# EAGLE design p32batt_B (EAGLE 6.5.0)
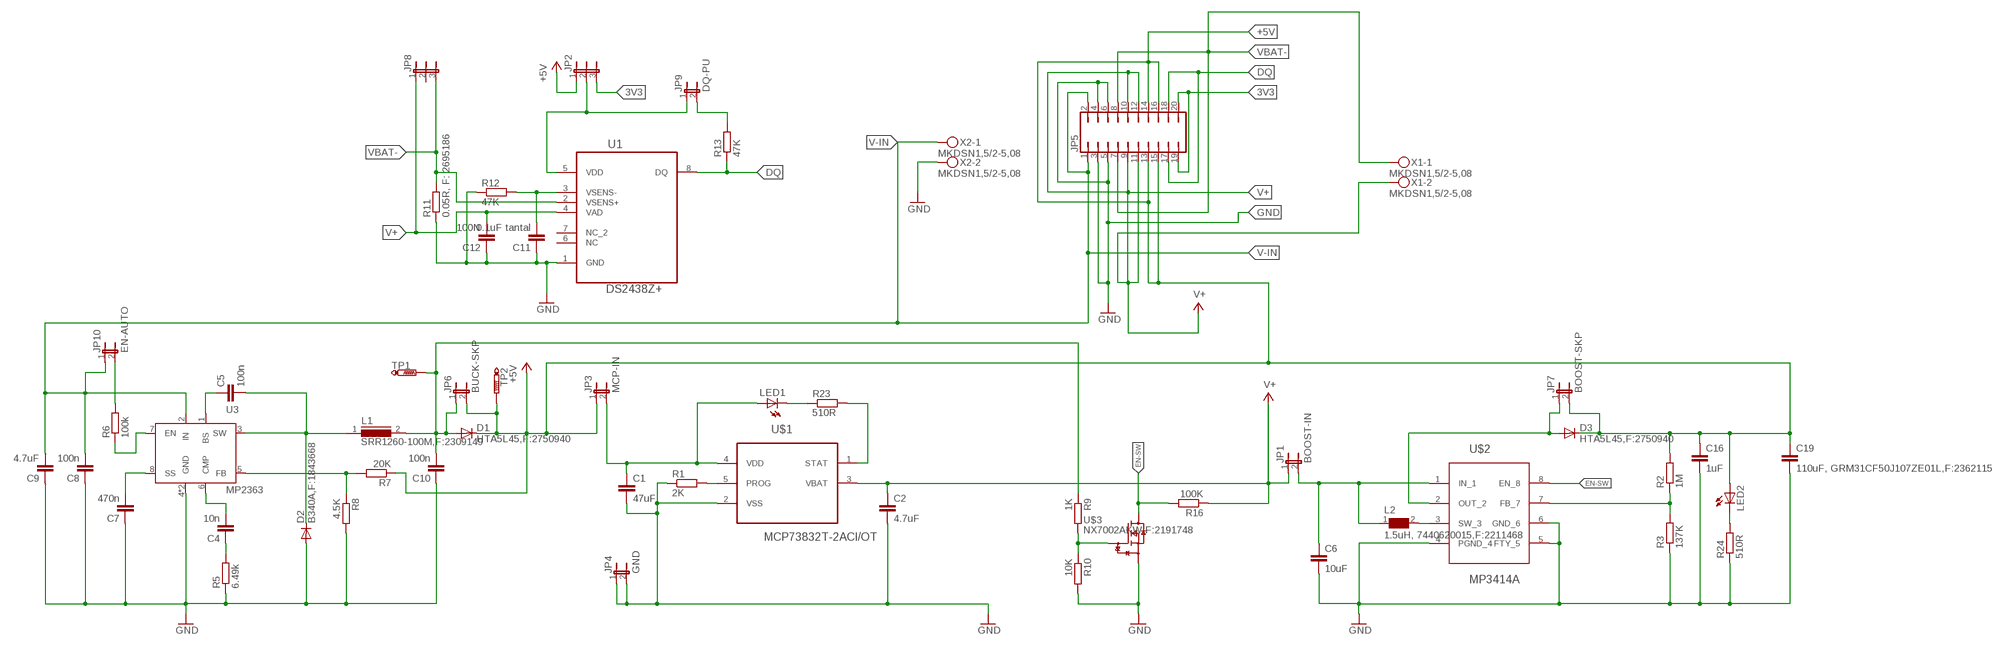
[diagram p0: schematic, sheet 1]

## Parts
C1  47uF  C-EUC1206  [C1206]
C2  4.7uF  C-EUC1206  [C1206]
C4  10n  C-EUC0805  [C0805]
C5  100n  C-EUC0805  [C0805]
C6  10uF  C-EUC1206  [C1206]
C7  470n  C-EUC0805  [C0805]
C8  100n  C-EUC0805  [C0805]
C9  4.7uF  C-EUC1206  [C1206]
C10  100n  C-EUC0805  [C0805]
C11  0.1uF tantal  C-EUC0805  [C0805]
C12  100N  C-EUC0805  [C0805]
C16  1uF  C-EUC1206  [C1206]
C19  110uF, GRM31CF50J107ZE01L,F:2362115  C-EUC1206  [C1206]
D1  HTA5L45,F:2750940  DIODE-DO214AC  [DO214AC]
D2  B340A,F:1843668  DIODE-DO214AC  [DO214AC]
D3  HTA5L45,F:2750940  DIODE-DO214AC  [DO214AC]
JP1  BOOST-IN  JP1E  [JP1]
JP2  JP2E  [JP2]
JP3  MCP-IN  JP1E  [JP1]
JP4  GND  JP1E  [JP1]
JP5  JP10Q  [JP10Q]
JP6  BUCK-SKP  JP1E  [JP1]
JP7  BOOST-SKP  JP1E  [JP1]
JP8  JP2E  [JP2]
JP9  DQ-PU  JP1E  [JP1]
JP10  EN-AUTO  JP1E  [JP1]
L1  SRR1260-100M,F:2309149  SRR1210  [SRR1210]
L2  1.5uH, 7440620015,F:2211468  WE-TPC-744062001_6823  [WE-TPC_6823]
LED1  LEDCHIPLED_0805  [CHIPLED_0805]
LED2  LEDCHIPLED_0805  [CHIPLED_0805]
R1  2K  R-EU_R0805  [R0805]
R2  1M  R-EU_R0805  [R0805]
R3  137K  R-EU_R0805  [R0805]
R5  6.49k  R-EU_R0805  [R0805]
R6  100k  R-EU_R0805  [R0805]
R7  20K  R-EU_R0805  [R0805]
R8  4.5K  R-EU_R0805  [R0805]
R9  1K  R-EU_R0805  [R0805]
R10  10K  R-EU_R0805  [R0805]
R11  0.05R, F: 2695186  R-EU_R2512  [R2512]
R12  47K  R-EU_R0805  [R0805]
R13  47K  R-EU_R0805  [R0805]
R16  100K  R-EU_R0805  [R0805]
R23  510R  R-EU_R0805  [R0805]
R24  510R  R-EU_R0805  [R0805]
TP1  PTR1PAD1-13  [P1-13]
TP2  PTR1PAD1-13  [P1-13]
U1  DS2438Z+  [SOIC127P600X175-8N]
U3  MP2363  [SOIC8E]
U$1  MCP73832T-2ACI/OT  [SOT95P280X145-5N]
U$2  MP3414A  [TSOT23-8]
U$3  NX7002AKW,F:2191748  NX7002AKW  [SOT323]
X1  MKDSN1,5/2-5,08  [MKDSN1,5/2-5,08]
X2  MKDSN1,5/2-5,08  [MKDSN1,5/2-5,08]

## Nets
3V3: JP2.3 JP5.19 JP5.20
+5V: C16.1 C19.1 D1.C D3.C JP2.1 JP3.1 JP5.13 JP5.14 JP5.15 JP5.16 JP6.2 JP7.2 LED2.A R2.2 R7.1 TP2.TP
DQ: JP5.17 JP5.18 R13.1 U1.8(DQ)
EN-SW: R16.2 U$2.8(EN_8) U$3.3(D)
GND: C1.2 C2.2 C6.2 C7.1 C8.1 C9.1 C10.1 C11.1 C12.1 C16.2 C19.2 D2.A JP4.1 JP4.2 JP5.3 JP5.4 JP5.5 JP5.6 R1.1 R3.1 R5.1 R8.2 R10.2 R11.1 R12.1 R24.1 U1.1(GND) U3.4(GND) U3.9(GND) U$1.2(VSS) U$2.4(PGND_4) U$2.5(FTY_5) U$2.6(GND_6) U$3.2(S) X2.2
N$3: R1.2 U$1.5(PROG)
N$4: R2.1 R3.2 U$2.7(FB_7)
N$5: L2.2 U$2.3(SW_3)
N$7: D3.A JP7.1 U$2.2(OUT_2)
N$8: LED2.C R24.2
N$9: R9.2 R10.1 U$3.1(G)
N$10: R23.2 U$1.1(STAT)
N$11: C1.1 JP3.2 LED1.A U$1.4(VDD)
N$12: LED1.C R23.1
N$13: JP9.2 R13.2
N$14: R6.1 U3.7(EN)
N$15: C4.2 U3.6(CMP)
N$16: C4.1 R5.2
N$17: R7.2 R8.1 U3.5(FB)
N$18: C6.1 JP1.2 L2.1 U$2.1(IN_1)
N$19: JP2.2 JP9.1 U1.5(VDD)
N$20: JP10.2 R6.2
N$21: C5.1 U3.1(BS)
N$22: C5.2 D2.C L1.1 U3.3(SW)
N$23: C7.2 U3.8(SS)
N$24: C10.2 D1.A JP6.1 L1.2 R9.1 TP1.TP
N$25: C11.2 R12.2 U1.3(VSENS-)
V+: C2.1 C12.2 JP1.1 JP5.9 JP5.10 JP5.11 JP5.12 JP8.1 R16.1 U1.4(VAD) U$1.3(VBAT) X1.2
V-IN: C8.2 C9.2 JP5.1 JP5.2 JP10.1 U3.2(IN) X2.1
VBAT-: JP5.7 JP5.8 JP8.3 R11.2 U1.2(VSENS+) X1.1
Unconnected: JP8.2 U1.6(NC) U1.7(NC_2)

## Library data of the parts
C1 C2 C4-C12 C16 C19 = rcl:C-EU: CAPACITOR, European symbol
D1-D3 = diode:DIODE-: DIODE
JP1 JP3 JP4 JP6 JP7 JP9 JP10 = jumper:JP1E: JUMPER
JP2 JP8 = jumper:JP2E: JUMPER
JP5 = jumper:JP10Q: JUMPER
L1 = inductors-2:SRR1210: SRR1210 Series - Shielded SMD Power Inductors Features : Available in E12 series Height of 4.3 mm Current rating up to 9 A RoHS compliant Applications : Input/output of DC/DC converters Power supplies
L2 = WE-TPC:WE-TPC: Shielded Tiny Power Inductor WE-TPC - Extremely flat power inductor - High current capability - High reliability and perfect soldering characteristics because of integrated soldering pad - magnetically shielded -- Portable power like PDA, digital camera, PCMICA-cards and displays -- DC/DC-converter -- Recommended for switching regulator IC's from Linear Technology, National Semiconductor, Texas Instruments and Fairchild Semiconductor; MPN: 744062001; OC_FARNELL: 1635868; OC_NEWARK: 08P2503; PACKAGE: 6823; SUPPLIER: WURTH ELEKTRONIK
LED1 LED2 = led:LED: LED OSRAM: - CHIPLED LG R971, LG N971, LY N971, LG Q971, LY Q971, LO R971, LY R971 LH N974, LH R974 LS Q976, LO Q976, LY Q976 LO Q996 - Hyper CHIPLED LW Q18S LB Q993, LB Q99A, LB R99A - SideLED LS A670, LO A670, LY A670, LG A670, LP A670 LB A673, LV A673, LT A673, LW A673 LH A674 LY A675 LS A676, LA A676, LO A676, LY A676, LW A676 LS A679, LY A679, LG A679 - Hyper Micro SIDELED® LS Y876, LA Y876, LO Y876, LY Y876 LT Y87S - SmartLED LW L88C, LW L88S LB L89C, LB L89S, LG L890 LS L89K, LO L89K, LY L89K LS L896, LA L896, LO L896, LY L896 - TOPLED LS T670, LO T670, LY T670, LG T670, LP T670 LSG T670, LSP T670, LSY T670, LOP T670, LYG T670 LG T671, LOG T671, LSG T671 LB T673, LV T673, LT T673, LW T673 LH T674 LS T676, LA T676, LO T676, LY T676, LB T676, LH T676, LSB T676, LW T676 LB T67C, LV T67C, LT T67C, LS T67K, LO T67K, LY T67K, LW E67C LS E67B, LA E67B, LO E67B, LY E67B, LB E67C, LV E67C, LT E67C LW T67C LS T679, LY T679, LG T679 LS T770, LO T770, LY T770, LG T770, LP T770 LB T773, LV T773, LT T773, LW T773 LH T774 LS E675, LA E675, LY E675, LS T675 LS T776, LA T776, LO T776, LY T776, LB T776 LHGB T686 LT T68C, LB T68C - Hyper Mini TOPLED® LB M676 - Mini TOPLED Santana® LG M470 LS M47K, LO M47K, LY M47K Source: http://www.osram.convergy.de LUXEON: - LUMILED® LXK2-PW12-R00, LXK2-PW12-S00, LXK2-PW14-U00, LXK2-PW14-V00 LXK2-PM12-R00, LXK2-PM12-S00, LXK2-PM14-U00 LXK2-PE12-Q00, LXK2-PE12-R00, LXK2-PE12-S00, LXK2-PE14-T00, LXK2-PE14-U00 LXK2-PB12-K00, LXK2-PB12-L00, LXK2-PB12-M00, LXK2-PB14-N00, LXK2-PB14-P00, LXK2-PB14-Q00 LXK2-PR12-L00, LXK2-PR12-M00, LXK2-PR14-Q00, LXK2-PR14-R00 LXK2-PD12-Q00, LXK2-PD12-R00, LXK2-PD12-S00 LXK2-PH12-R00, LXK2-PH12-S00 LXK2-PL12-P00, LXK2-PL12-Q00, LXK2-PL12-R00 Source: www.luxeon.com KINGBRIGHT: KA-3528ASYC Source: www.kingbright.com
R1-R3 R5-R13 R16 R23 R24 = rcl:R-EU_: RESISTOR, European symbol
TP1 TP2 = testpad:PTR1: TEST PIN
U1 = Maxim_By_element14_Batch_1:DS2438Z+: Smart Battery Monitor; MPN: DS2438Z+; OC_FARNELL: 1455593; OC_NEWARK: 27K7484; PACKAGE: SOIC-8; SUPPLIER: Maxim
U3 = mps:MP2363
U$1 = Microchip-MCP73832T-2ACI_OT:MCP73832T-2ACI/OT: Charge Management Controller; MPN: MCP73832T-2ACI/OT; OC_FARNELL: 1332159; OC_NEWARK: 88K5656; PACKAGE: SOT-5; SUPPLIER: Microchip
U$2 = mps:MP3414A
U$3 = nxp_60_1_1:NX7002AKW
X1 X2 = con-phoenix-508:MKDSN1,5/2-5,08: MKDSN 1,5/ 2-5,08 Printklemme Nennstrom: 13,5 A Nennspannung: 250 V Rastermaß: 5,08 mm Polzahl: 2 Anschlussart: Schraubanschluss Montage: Löten Anschlussrichtung Leiter/Platine: 0 ° Artikelnummer: 1729128 Source: http://eshop.phoenixcontact.com .. 1729128.pdf; MPN: MKDSN 1,5/2-5.08; OC_FARNELL: 1792903; OC_NEWARK: 30M2397

## Net classes
0 default: width 0.406 mm, drill 0.406 mm, clearance 0.254 mm

## Board
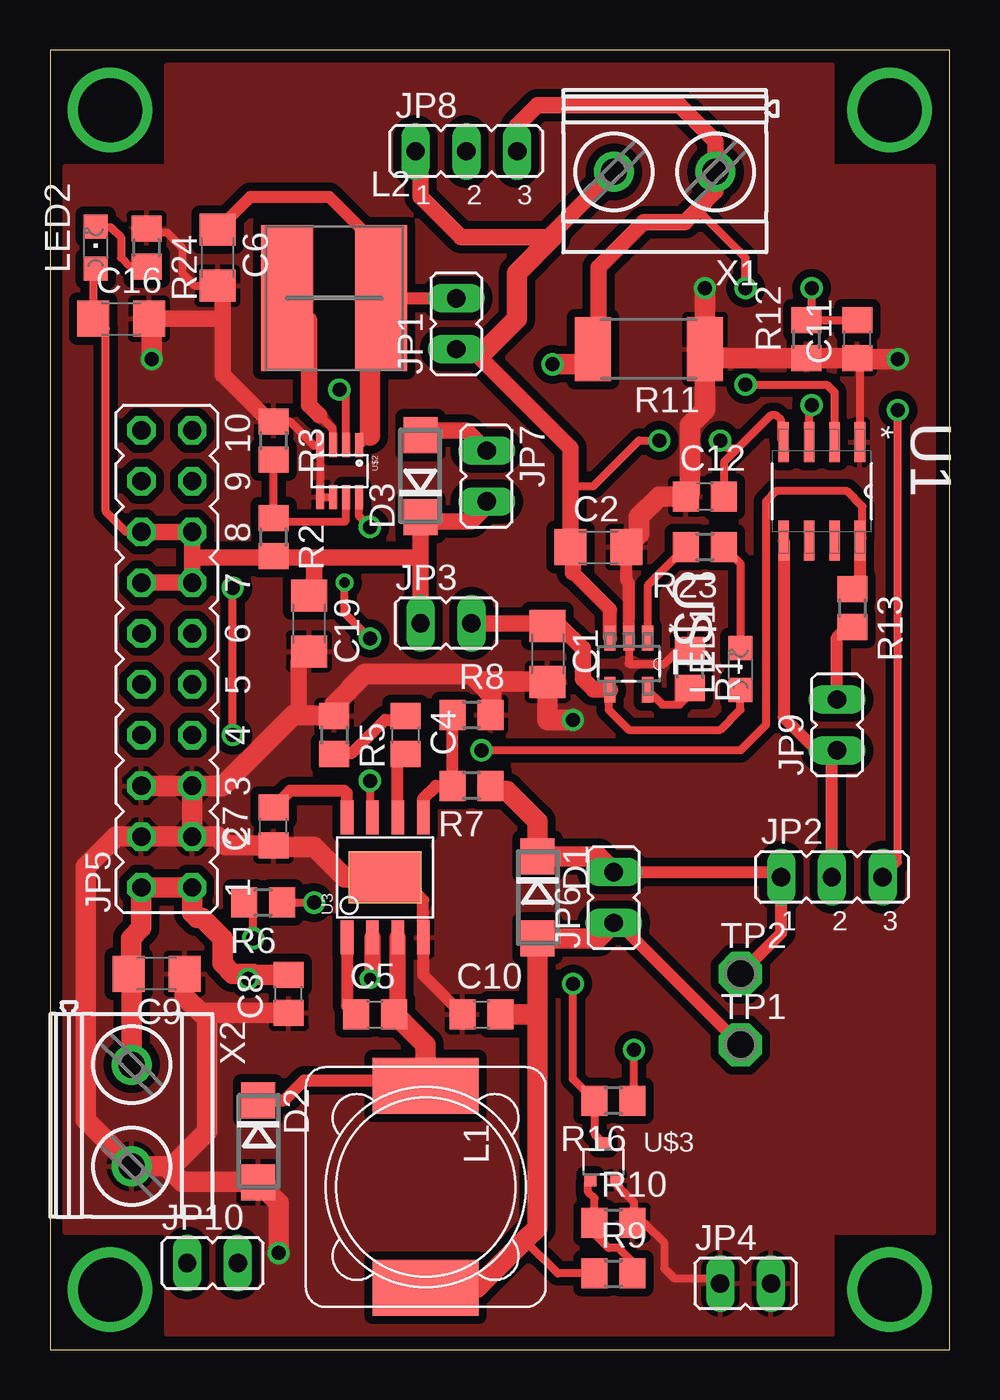
[diagram p1: board, top side]
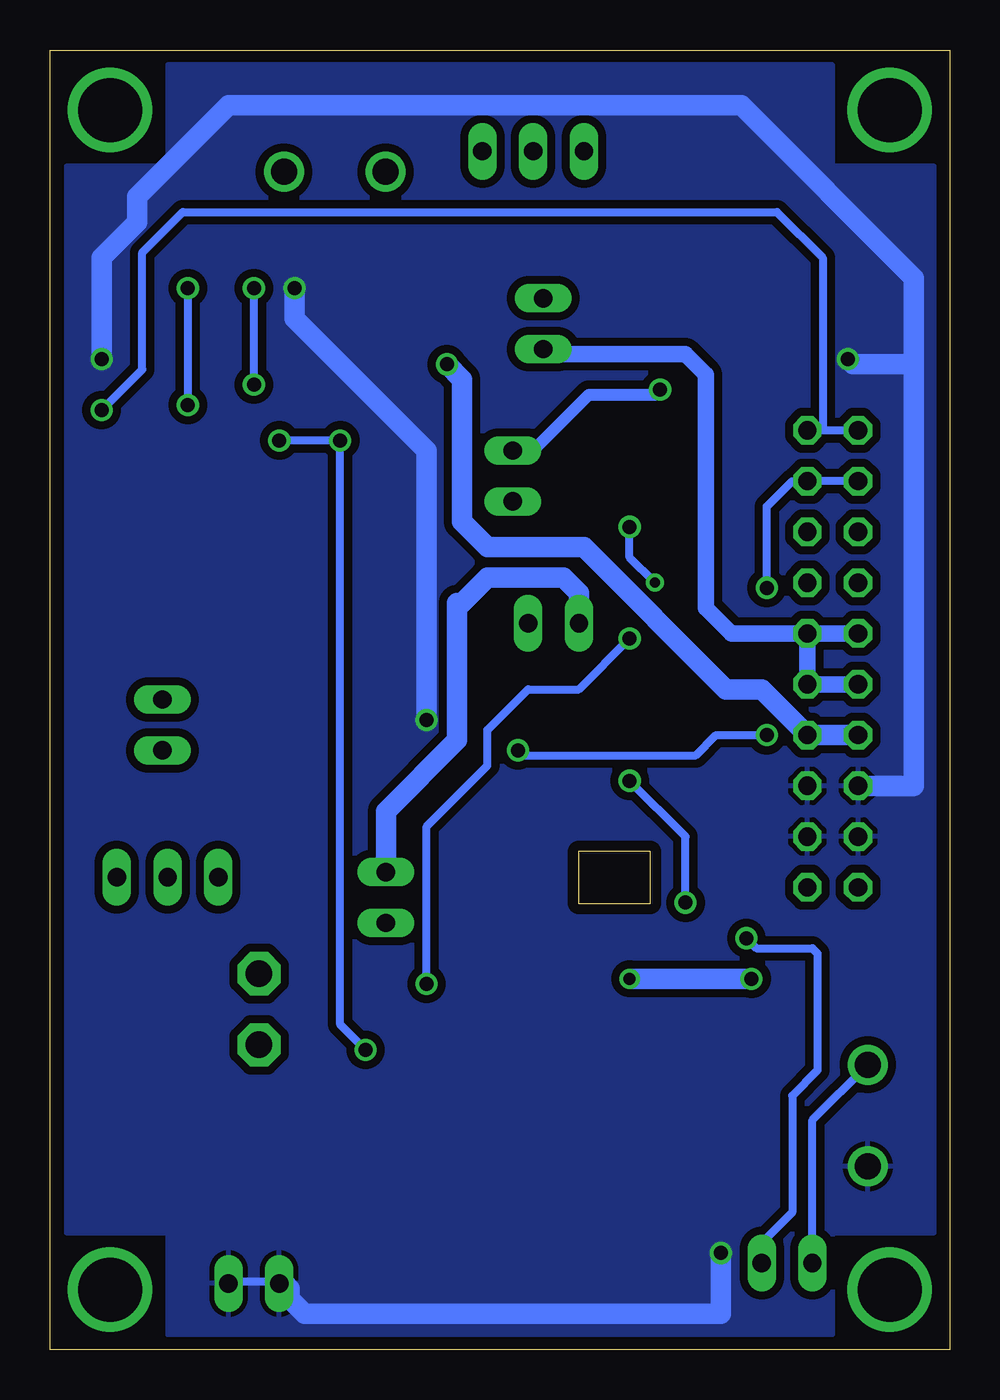
[diagram p2: board, bottom side, seen from below]

Size 45 x 65 mm. Coordinates in mm from the lower left corner, seen from the top.
Outline: 0,0 45,0 45,65 0,65 0,0
Copper layers (1*16): Top 0.035mm / dielectric 1.5mm / Bottom 0.035mm
Design rules "default *": minimum track width 10mil, minimum drill 14mil, track to track 8mil, track to pad 8mil, pad to pad 8mil, via to via 8mil, smd to smd 8mil, copper to edge 20mil, drill to drill 8mil, minimum pad ring 10mil, minimum via ring 8mil, stop-mask expansion 4mil, vias tented up to drill 0mil, thermal gap 10mil

### Footprints (pad centres in the part's own frame; a part is rotated, then mirrored left to right if it is on the bottom)
C1206 = smd 1.6 x 1.8: 1 -1.4,0; 2 1.4,0
C0805 = smd 1.3 x 1.5: 1 -0.95,0; 2 0.95,0
DO214AC = smd 1.8 x 1.7: A 2.05,0; C -2.05,0
JP1 = drill 0.914 long: 1 0,-1.27; 2 0,1.27
JP2 = drill 0.914 long: 1 -2.54,0; 2 0,0; 3 2.54,0
JP10Q = drill 0.914 octagon: 1 -11.43,-1.27; 2 -11.43,1.27; 3 -8.89,-1.27; 4 -8.89,1.27; 5 -6.35,-1.27; 6 -6.35,1.27; 7 -3.81,-1.27; 8 -3.81,1.27; 9 -1.27,-1.27; 10 -1.27,1.27; 11 1.27,-1.27; 12 1.27,1.27; 13 3.81,-1.27; 14 3.81,1.27; 15 6.35,-1.27; 16 6.35,1.27; 17 8.89,-1.27; 18 8.89,1.27; 19 11.43,-1.27; 20 11.43,1.27
SRR1210 = smd 2.8 x 5.3: 1 -5.05,0; 2 5.05,0
WE-TPC_6823 = smd 2.6 x 7.3: 1 -2.35,0; 2 2.35,0
CHIPLED_0805 = smd 1.2 x 1.2: A 0,-1.05; C 0,1.05
R0805 = smd 1.3 x 1.5: 1 -0.95,0; 2 0.95,0
R2512 = smd 1.8 x 3.2: 1 -2.8,0; 2 2.8,0
P1-13 = drill 1.321 pad 2.159 octagon: TP 0,0
SOIC127P600X175-8N = smd 1.981 x 0.533: 1 -2.464,1.905; 2 -2.464,0.635; 3 -2.464,-0.635; 4 -2.464,-1.905; 5 2.464,-1.905; 6 2.464,-0.635; 7 2.464,0.635; 8 2.464,1.905
SOIC8E = smd 0.635 x 1.7: 1 -1.905,-3; 2 -0.635,-3; 3 0.635,-3; 4 1.905,-3; 5 1.905,3; 6 0.635,3; 7 -0.635,3; 8 -1.905,3 | smd 3.6 x 2.6: 9 0,0
SOT95P280X145-5N = smd 1.27 x 0.559: 1 -1.295,0.94; 2 -1.295,0; 3 -1.295,-0.94; 4 1.295,-0.94; 5 1.295,0.94
TSOT23-8 = smd 0.4 x 1.2: 1 -0.975,-1.3; 2 -0.325,-1.3; 3 0.325,-1.3; 4 0.975,-1.3; 5 0.975,1.3; 6 0.325,1.3; 7 -0.325,1.3; 8 -0.975,1.3
SOT323 = smd 0.6 x 0.6: 1 -0.65,-0.925; 2 0.65,-0.925; 3 0,0.925
MKDSN1,5/2-5,08 = drill 1.3 pad 2: 1 -2.561,0.025; 2 2.519,0.025

### Placement (x,y rotation side)
C1  24.89,34.8 270 top
C2  27.43,40.13 0 top
C4  17.78,30.73 270 top
C5  16.26,16.76 0 top
C6  8.38,54.61 270 top
C7  11.18,26.16 90 top
C8  11.94,17.78 90 top
C9  5.33,18.8 180 top
C10  21.59,16.76 0 top
C11  40.39,50.55 90 top
C12  32.77,42.67 0 top
C16  3.56,51.56 0 top
C19  12.95,36.32 270 top
D1  24.38,22.61 270 top
D2  10.41,10.41 270 top
D3  18.54,43.69 90 top
JP1  20.32,51.31 0 top
JP2  39.12,23.62 0 top
JP3  19.81,36.32 270 top
JP4  34.8,3.3 270 top
JP5  5.84,34.54 90 top
JP6  28.19,22.61 0 top
JP7  21.84,43.69 180 top
JP8  20.83,59.93 0 top
JP9  39.37,31.24 0 top
JP10  8.13,4.32 270 top
L1  18.8,8.13 270 top
L2  14.22,52.58 180 top
LED1  34.54,34.04 0 top
LED2  2.29,55.12 0 top
R1  32,34.04 270 top
R2  11.18,40.64 270 top
R3  11.18,45.47 270 top
R5  14.22,30.73 270 top
R6  10.67,22.35 180 top
R7  21.08,28.19 180 top
R8  21.08,31.75 0 top
R9  28.19,3.81 0 top
R10  28.19,6.35 0 top
R11  29.97,50.04 180 top
R12  37.85,50.55 90 top
R13  40.13,37.08 270 top
R16  28.19,12.45 180 top
R23  32.77,40.13 180 top
R24  4.83,55.12 270 top
TP1  34.54,15.24 0 top
TP2  34.54,18.8 0 top
U1  38.61,42.93 270 top
U3  16.76,23.62 0 top
U$1  28.96,34.29 270 top
U$2  14.48,43.94 180 top
U$3  27.69,9.4 0 top
X1  30.73,58.93 180 top
X2  4.06,11.68 270 top

### Tracks (layer width: path | path; a pad name or v marks a point on that pad's centre or on a via)
3V3  (via drill 0.7)
  Top 0.406: JP2.3 42.42,24.38 v42.42,46.99
  Bottom 0.406: v42.42,46.99 40.39,49.02 40.39,54.86 38.35,56.9 8.64,56.9 6.35,54.61 6.35,45.97 | 6.35,45.97 JP5.19 | JP5.20 6.35,45.97
+5V
  Top 0.406: LED2.A 2.16,53.94 C16.1 2.29,51.56 2.79,51.05 2.79,41.91 3.81,40.89 JP5.16
  Top 0.61: JP6.2 36.32,23.88 JP2.1 36.58,20.83 TP2.TP
  Top 0.813: JP7.2 21.84,42.16 21.08,41.4 18.78,41.4 D3.C 18.54,39.62 | 18.54,39.62 JP3.1 | 13.21,39.62 11.24,39.62 R2.2 11.11,39.62 7.11,39.62 | 13.21,39.62 18.54,39.62 | JP5.16 JP5.15 7.11,39.62 | 7.11,39.62 JP5.13 JP5.14 | C19.1 13.21,37.98 13.21,39.62
  Top 1.016: R7.1 22.29,27.94 22.86,27.94 24.38,26.42 D1.C 27.41,24.66 JP6.2
  Bottom 1.016: JP3.1 18.54,37.85 19.3,38.61 23.11,38.61 24.38,37.34 24.64,37.34 24.64,30.48 28.19,26.92 JP6.2
A4  (via drill 3.2)
  other vias: 3,3
DQ  (via drill 0.7)
  Top 0.406: U1.8 40.64,40.59 40.64,42.16 39.88,42.93 36.32,42.93 35.81,42.42 35.81,31.24 34.54,29.97 v21.59,29.97 | v9.14,30.73 v9.14,38.1
  Top 0.61: U1.8 40.51,38.67 R13.1
  Bottom 0.406: v21.59,29.97 21.34,29.72 12.7,29.72 11.68,30.73 v9.14,30.73 | v9.14,38.1 9.14,42.16 7.87,43.43 JP5.17 JP5.18
EN-SW  (via drill 0.5, 0.7)
  Top 0.406: U$3.3 27.24,10.77 R16.2 26.16,13.53 v26.16,18.29 | v16,35.56 14.73,36.83 v14.73,38.35 | v16,41.15 15.45,41.7 U$2.8
  Bottom 0.406: v26.16,18.29 26.16,26.16 23.11,29.21 23.11,30.99 21.08,33.02 18.54,33.02 v16,35.56 | v14.73,38.35 16,39.62 v16,41.15
GND  (via drill 0.7)
  Top 0.406: U$3.2 28.34,8.24 29.21,7.37 29.21,6.42 R10.2 29.72,6.35 30.73,5.33 30.73,4.06 31.24,3.56 33.27,3.56 JP4.1 | U$2.4 13.47,45.21 | 13.47,45.21 13.21,45.21 12,46.42 R3.1 | 13.47,45.21 13.5,45.18 U$2.5 U$2.6 | R24.1 5.01,55.88 5.84,55.88 6.6,55.12 6.6,53.85 7.24,53.21 C6.2 | U$1.2 28.96,34.29 30.73,34.29 31.43,34.99 R1.1 | 40.45,49.53 40.51,49.47 U1.1
  Top 0.61: C10.1 18.67,18.73 U3.4 18.67,22.48 17.78,23.37 17.02,23.37 U3.9 | R5.1 14.21,32.24 | 22.1,32.51 22.1,31.82 R8.2 | U$1.2 28.96,38.35 28.83,38.48 C2.2
  Top 0.813: C19.2 12.45,34.41 12.45,31.74 | C6.2 8.64,52.96 8.64,51.56 | 8.64,51.56 8.64,48.77 10.99,46.42 R3.1 | C16.2 8.64,51.56
  Top 1.016: 5.97,9.02 5.82,9.16 X2.2 1.78,11.48 1.78,24.13 3.3,25.65 JP5.3 | 5.97,9.02 6.6,8.38 10.4,8.38 D2.A 11.43,7.35 v11.43,4.83 | U3.9 14.73,23.62 13.21,25.15 11.24,25.15 C7.1 8.82,25.21 8.38,25.65 JP5.3 | JP5.3 JP5.4 | JP5.5 JP5.3 | JP5.5 JP5.6 | 11.5,16.83 C8.1 7.87,16.83 | 7.87,16.83 7.87,10.92 5.97,9.02 | C9.1 6.73,17.65 7.55,16.83 7.87,16.83 | R5.1 12.45,31.74 12.19,31.74 8.64,28.19 JP5.5 | C16.2 5.08,51.44 v5.08,49.53 | v42.42,49.53 40.45,49.53 C11.1 R12.1 33.21,49.6 R11.1 32.77,47 32,46.23 32,42.86 C12.1 30.48,42.67 29.46,41.66 29.46,40.76 C2.2 | 14.21,32.24 15.75,33.78 21.08,33.78 21.46,33.4 | 21.46,33.4 22.1,32.77 22.1,32.51 | 21.46,33.4 C1.2 24.89,31.5 v26.16,31.5 | v32.77,53.09 32.77,49.53
  Bottom 0.406: JP4.2 36,3.4 34,3.4 JP4.1
  Bottom 1.016: JP4.1 33.27,3.3 33.02,3.05 33.02,2.54 32.26,1.78 11.43,1.78 v11.43,4.83 | 4.06,9.14 X2.2 | 1.78,49.28 1.78,28.19 JP5.6 | 1.78,49.28 1.78,53.59 10.41,62.23 36.07,62.23 40.64,57.66 40.64,56.39 42.42,54.61 v42.42,49.53 | v5.08,49.53 4.83,49.28 1.78,49.28 | v26.16,31.5 26.16,44.96 32.77,51.56 v32.77,53.09
  pour Top (isolate 0.406): 0.76,59.18 5.84,59.18 5.84,64.26 39.12,64.26 39.12,59.18 44.2,59.18 44.2,5.84 39.12,5.84 39.12,0.76 5.84,0.76 5.84,5.84 0.76,5.84
  pour Bottom (isolate 0.406): 0.76,59.18 5.84,59.18 5.84,64.26 39.12,64.26 39.12,59.18 44.2,59.18 44.2,5.84 39.12,5.84 39.12,0.76 5.84,0.76 5.84,5.84 0.76,5.84
N$1  (via drill 3.2)
  other vias: 3,62
N$2  (via drill 3.2)
  other vias: 42,62
N$3
  Top 0.406: U$1.5 30.63,32.26 31.5,32.26 32,32.77 R1.2
N$4
  Top 0.406: R3.2 R2.1 11.36,41.4 14.73,41.4 14.8,41.47 U$2.7
N$5
  Top 0.406: U$2.3 14.15,46.05 13.46,46.74
  Top 0.813: 13.46,46.74 12.95,47.24 12.95,51.5 L2.2
  pour Top (isolate 0.254, no thermals): 13.28,46.38 13.94,45.95 14.35,45.95 14.35,46.13 13.74,47.02
N$6  (via drill 3.2)
  other vias: 42,3
N$7  (via drill 0.7)
  Top 0.406: U$2.2 14.8,47.68 v14.48,48.01
  Top 0.813: D3.A 18.78,45.97 20.83,45.97 21.34,45.47 21.34,44.96 JP7.1
  Bottom 0.61: JP7.1 20.83,44.96 18.03,47.75 14.73,47.75 v14.48,48.01
N$8
  Top 0.406: LED2.C 2.32,56.13 3.05,56.13 3.56,55.63 3.56,54.61 4,54.17 R24.2
N$9
  Top 0.406: R9.2 29.14,4.38 28.45,5.08 27.94,5.08 27.18,5.84 27.18,6.28 R10.1 27.24,7.55 26.92,7.87 26.92,8.36 U$3.1
N$10
  Top 0.406: R23.2 29.9,38.21 U$1.1
N$11
  Top 0.406: U$1.4 27.94,32.92 27.94,32 28.96,30.99 33.53,30.99 34.54,32 LED1.A
  Top 0.813: 25.02,36.32 C1.1 | JP3.2 24.77,36.32 C1.1 | C1.1 25.52,36.2 26.67,35.05 26.67,33.53 27.18,33.02 27.99,33.02 U$1.4
N$12
  Top 0.406: R23.1 34.54,39.3 LED1.C
N$13
  Top 0.61: JP9.2 39.37,35.63 39.88,36.13 R13.2
N$14  (via drill 0.7)
  Top 0.406: R6.1 v13.21,22.35 | v16,28.45 16,26.75 U3.7
  Bottom 0.406: v13.21,22.35 13.21,25.65 v16,28.45
N$15
  Top 0.61: U3.6 17.4,29.51 C4.2
N$16
  Top 0.61: R5.2 15.11,29.84 16.76,31.5 17.49,31.5 C4.1
N$17
  Top 0.61: U3.5 18.67,27.56 19.3,28.19 R7.2 R8.1
N$18
  Top 0.406: U$2.1 15.52,45.24 16,45.72
  Top 0.61: C6.1 10.03,57.66 13.97,57.66 16.57,55.05 L2.1 JP1.2
  Top 1.016: 16,45.72 16,49.78 16.51,50.29 16.51,52.51 L2.1
N$19
  Top 0.61: JP2.2 39.12,29.72 | U1.5 36.7,31.62 38.61,29.72 39.12,29.72 | 39.12,29.72 JP9.1
N$20  (via drill 0.7)
  Top 0.406: v10.16,20.57 10.16,21.91 R6.2
  Bottom 0.406: v10.16,20.57 9.65,20.07 6.86,20.07 6.6,19.81 6.6,13.97 7.87,12.7 7.87,6.86 9.4,5.33 JP10.2
N$21
  Top 0.61: U3.1 14.86,17.21 C5.1
N$22
  Top 0.61: 17.4,16.96 C5.2 | D2.C 11.7,12.46 12.7,13.46 18.51,13.46 L1.1
  Top 0.813: U3.3 17.4,16.96
  Top 1.016: C5.2 17.27,16.76 18.8,15.24 L1.1
N$23
  Top 0.61: U3.8 14.86,27.81 14.73,27.94 12,27.94 C7.2
N$24
  Top 0.406: R9.1 25.4,3.81 23.75,5.46
  Top 0.61: TP1.TP 28.45,21.34 JP6.1
  Top 1.016: L1.2 21.37,3.08 23.75,5.46 24.38,6.1 24.38,16.51 | 24.38,16.51 D1.A 27.41,20.56 JP6.1 | C10.2 24.13,16.76 24.38,16.51
N$25  (via drill 0.7)
  Top 0.406: R12.2 38.1,51.75 | 38.1,51.75 v38.1,53.09 | v38.1,47.24 37.97,47.12 U1.3 | 38.1,51.75 38.35,51.5 C11.2
  Bottom 0.406: v38.1,53.09 v38.1,47.24
V+  (via drill 0.7)
  Top 0.406: U1.4 36.58,45.52 36.58,46.48 36.32,46.74 36.07,46.74 34.42,45.09 | 34.42,45.09 33.72,44.38 C12.2 | 26.16,40 26.16,42.93 26.42,43.18 27.18,43.18 29.46,45.47 v30.48,45.47 | v33.53,45.47 33.91,45.09 34.42,45.09 | R16.1 29.21,12.51 v29.21,14.99
  Top 0.711: U$1.3 28.02,37.01 26.16,38.86
  Top 0.813: 26.16,38.86 26.16,40 C2.1 26.03,45.09 21.08,50.04 20.83,50.04 JP1.1 | X1.2 25.15,55.83 25.15,55.63 20.57,55.63 18.54,57.66 18.54,59.68 JP8.1
  Top 1.016: 25.15,55.63 23.37,53.85 23.37,51.56 21.84,50.04 20.83,50.04
  Bottom 0.406: v33.53,45.47 v30.48,45.47 30.48,16.26 v29.21,14.99
  Bottom 0.813: JP1.1 20.07,49.78 13.21,49.78 12.19,48.77 12.19,37.08 10.92,35.81 JP5.11 | JP5.12 JP5.11 | JP5.10 JP5.9 JP5.11
V-IN  (via drill 0.6, 0.7)
  Top 0.406: v9.91,18.54 10,18.6 10,18.8
  Top 0.61: 16.13,18.67 v16,18.54
  Top 0.813: U3.2 16.13,18.67
  Top 1.016: X2.1 4.09,18.64 C9.2 4.06,18.93 4.06,20.57 4.57,21.08 JP5.2 JP5.1 7.11,21.84 7.37,21.59 7.62,21.59 8.64,20.57 8.64,19.3 9.14,18.8 10,18.8 10.16,18.8 | 11.87,18.8 C8.2 10.09,18.73 v9.91,18.54
  Bottom 0.406: JP10.1 6.86,11.48 X2.1
  Bottom 1.016: v16,18.54 v9.91,18.54
VBAT-  (via drill 0.7)
  Top 0.406: R11.2 27.43,49.78 | v34.8,48.26 38.86,48.26 39.24,47.88 U1.2 | v34.8,53.09 34.8,54.61 32.38,57.02
  Top 0.813: R11.2 27.43,50.3 27.43,54.1 29.72,56.39 31.75,56.39 32.38,57.02 33.3,57.93 X1.1 33.3,60.43 31.5,62.23 24.38,62.23 23.37,61.21 JP8.3
  Top 1.016: R11.2 26.41,49.28 v25.15,49.28
  Bottom 0.406: v34.8,48.26 v34.8,53.09
  Bottom 1.016: v25.15,49.28 24.38,48.51 24.38,41.4 23.11,40.13 18.29,40.13 11.18,33.02 9.4,33.02 JP5.7 JP5.8

### Text on the board
Document: B+ | NC | B- | R24 | L2 | C6 | B+ | B- | LED2 | R11 | C11 | R12 | C16 | MP3414 | BOOST ON/OFF | 3V3 | R3 | 1 | 1 | C12 | DQ | BOOST D | 5V | R2 | D3 | DS2438 | C2 | 5V | MCP | R23 | R13 | C19 | 1 | B+ | C4 | R8 | B+ | LED1 | R5 | C1 | R1 | B- | MCP73832 | R7 | PULL-UP | GND | C7 | GND | 5V | DS-VCC | 3V3 | R6 | IN | D1 | IN+ | MP2363 | C9 | 1 | BUCK ON/OFF | C5 | C10 | 5V TP | C8 | BUCK TP | D2 | R16 | NX | BattBackup | 7002 | CreditCom | (-) | R10 | L1 | R9 | 6-26V